# Altium schematic sheet Arduino.SchDoc
size A
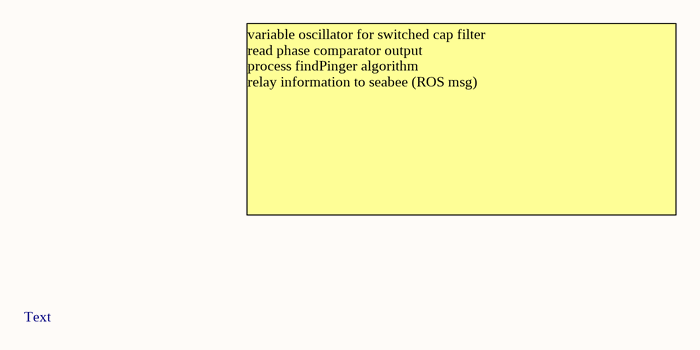
[diagram p0: Arduino.SchDoc]

## Notes on the sheet
- variable oscillator for switched cap filter
  read phase comparator output
  process findPinger algorithm
  relay information to seabee (ROS msg)
- Text